# Altium schematic sheet ADC.SchDoc
size A4
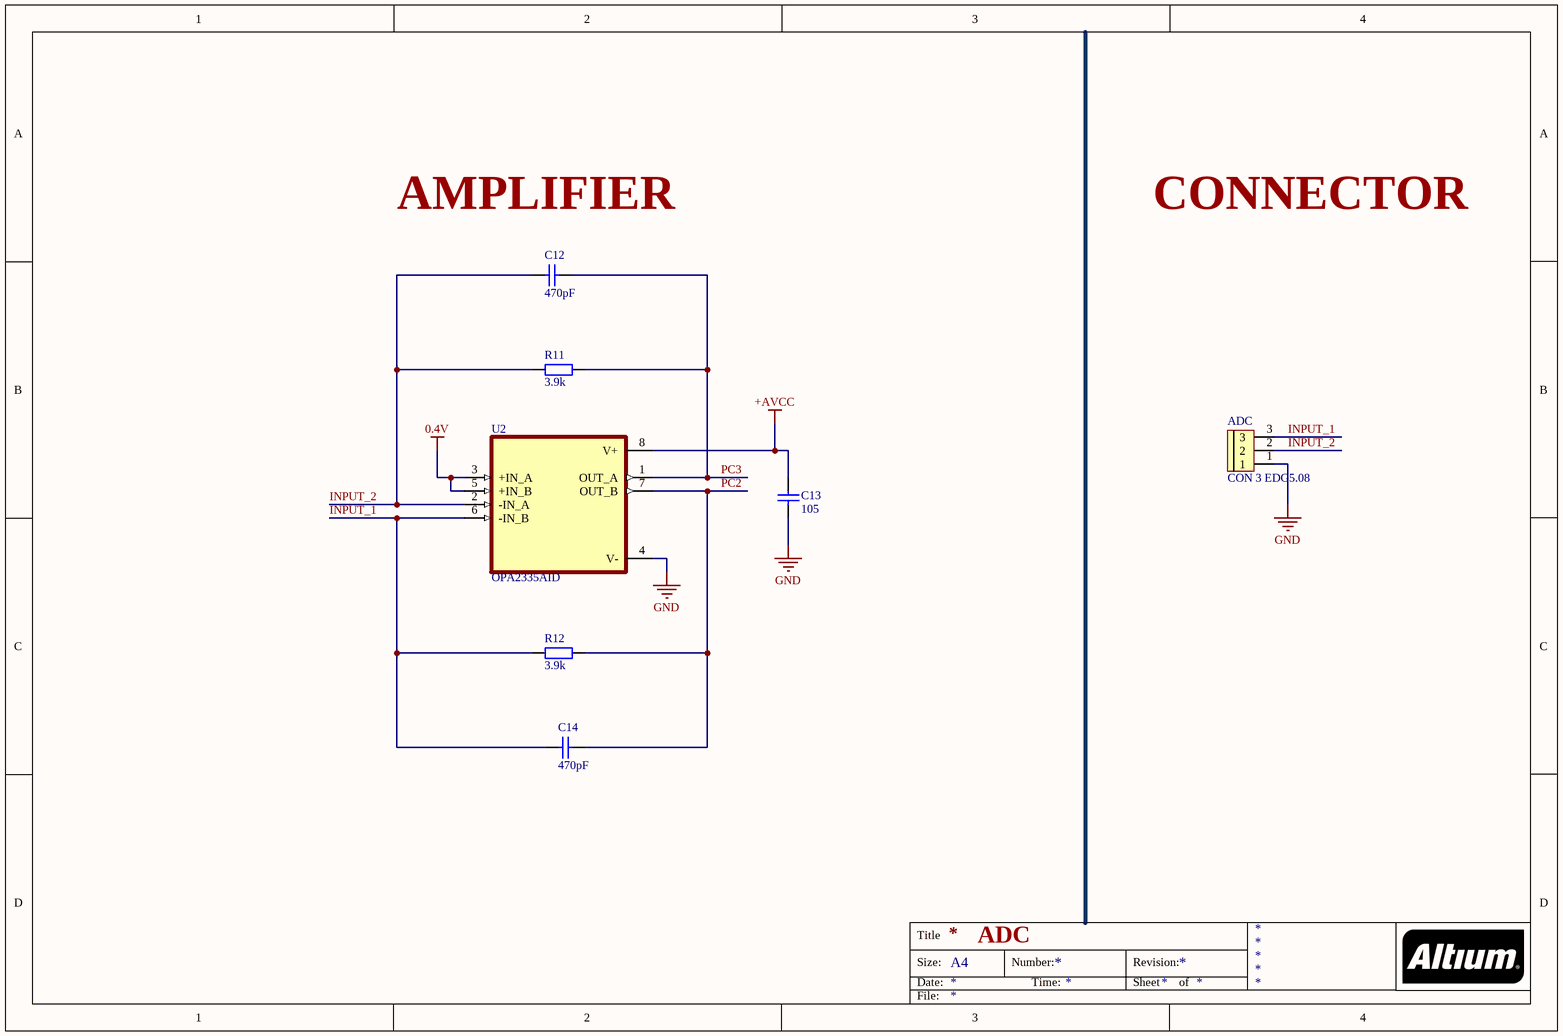
[diagram p0: ADC.SchDoc]

## Parts
ADC  CON 3 EDG5.08  [CON 3 3EDG5.08]
C12  470pF  [tu 0603]
C13  105  [tu 1206]
C14  470pF  [tu 0603]
R11  3.9k  [tro smd 0603]
R12  3.9k  [tro smd 0603]
U2  OPA2335AID  [SOIC127P599X175-8N]

## Nets
0.4V: U2.3(+IN_A) U2.5(+IN_B)
+AVCC: C13.1 U2.8(V+)
GND: ADC.1 C13.2 U2.4(V-)
INPUT_1: ADC.3 C14.2 R12.1 U2.6(-IN_B)
INPUT_2: ADC.2 C12.2 R11.1 U2.2(-IN_A)
PC2: C14.1 R12.2 U2.7(OUT_B)
PC3: C12.1 R11.2 U2.1(OUT_A)

## Notes on the sheet
- AMPLIFIER
- CONNECTOR
- ADC
- Title
- Size:
- Date:
- A4
- Number:
- Time:
- Revision:
- Sheet
- of
- File:

## Library data of the parts
ADC = CON 3 EDG5.08: Cắm; Ten_Linh_Kien: CON 3 2EDG5.08-3P 5.08MM ( Xanh Cong); Ma_Hang: MH000760; Ghi_Chu: *; Kieu_Chan: *; Don_Vi: Con; Chung_Loai: Cắm
C12 C14 = Tu 0603 470pF 50V 10%: Dán; Don_Vi: Con; So_Chan: 2; Ten_Linh_Kien: Tụ 0603 470P 50V 10%; Ma_Hang: MH004571; Chung_Loai: Dán; Kieu_Chan: *
C13 = Tu 1206 105 50V 20%: Dán; Don_Vi: Con; So_Chan: 2; Ten_Linh_Kien: Tụ 1206 105-1uF 20% 50V; Ma_Hang: MH004545; Chung_Loai: Dán; Kieu_Chan: *
R11 R12 = Tro 0603 1% 3.9k: Dán; So_Chan: 2; Ten_Linh_Kien: Trở 0603 1% 3.9k; Ma_Hang: MH005793; Don_Vi: Con; Chung_Loai: Dán; Kieu_Chan: *
U2 = OPA2335AID: MF: {'manufacturer': u'Texas Instruments'}; Package: None; Price: None; Value: *; MP: OPA2335AID; Availability: Unavailable